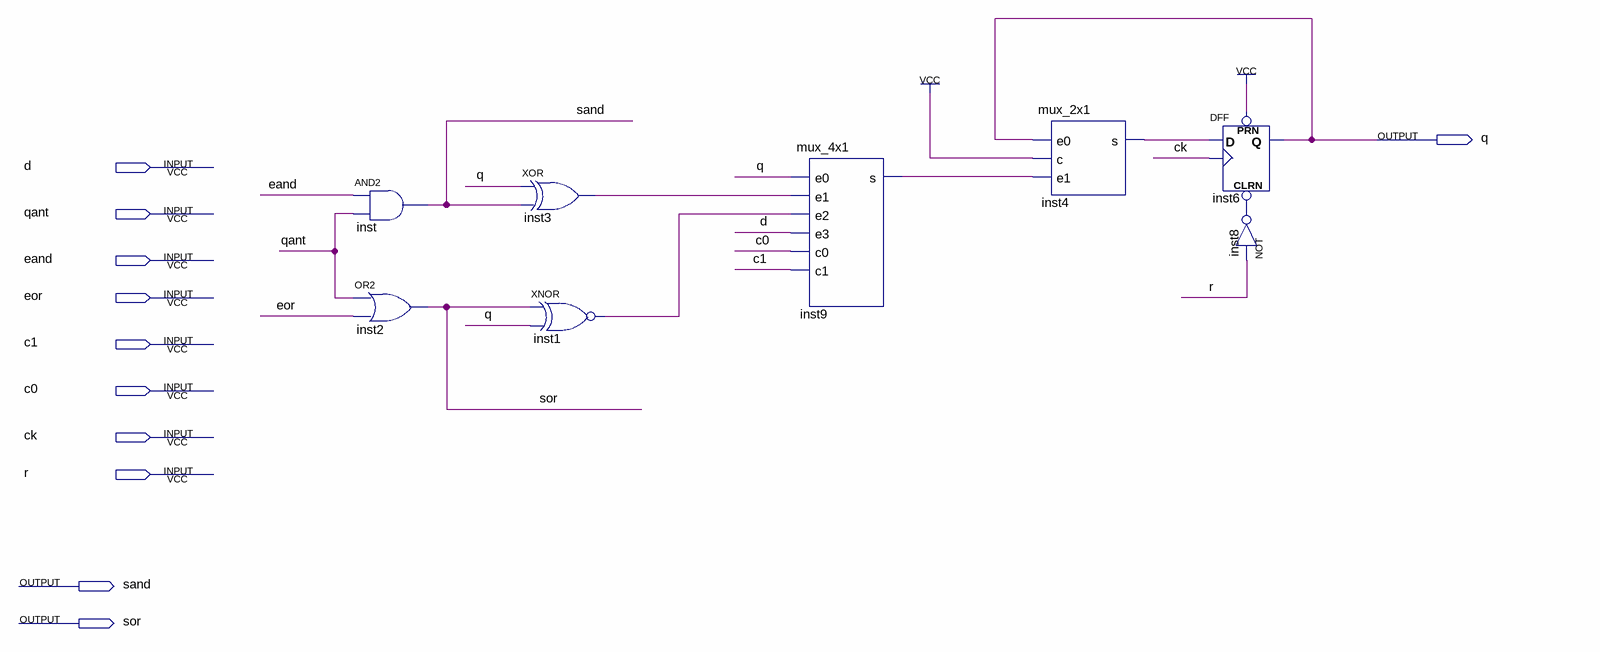
[diagram p0: schematic sheet]
// Quartus schematic cont_gen_1bit.bdf as structural Verilog: 8 symbols, 11 pins
module cont_gen_1bit (
  input  d,
  input  qant,
  input  eand,
  input  eor,
  input  c1,
  input  c0,
  input  ck,
  input  r,
  output q,
  output sand,
  output sor
);

  wire inst1_out, inst3_out, inst4_s, inst8_out, inst9_s;

  and inst (sand, eand, qant);
  or inst2 (sor, qant, eor);
  xor inst3 (inst3_out, q, sand);
  xnor inst1 (inst1_out, sor, q);
  mux_4x1 inst9 (.e0(q), .e1(inst3_out), .e2(inst1_out), .e3(d), .c0(c0), .c1(c1), .s(inst9_s));
  mux_2x1 inst4 (.e0(q), .c(1'b1), .e1(inst9_s), .s(inst4_s));
  DFF inst6 (.CLRN(inst8_out), .CLK(ck), .D(inst4_s), .PRN(1'b1), .Q(q));
  not inst8 (inst8_out, r);
endmodule
